# EAGLE design Arduino-Pro-Mini-CNC (EAGLE 6.5.0)
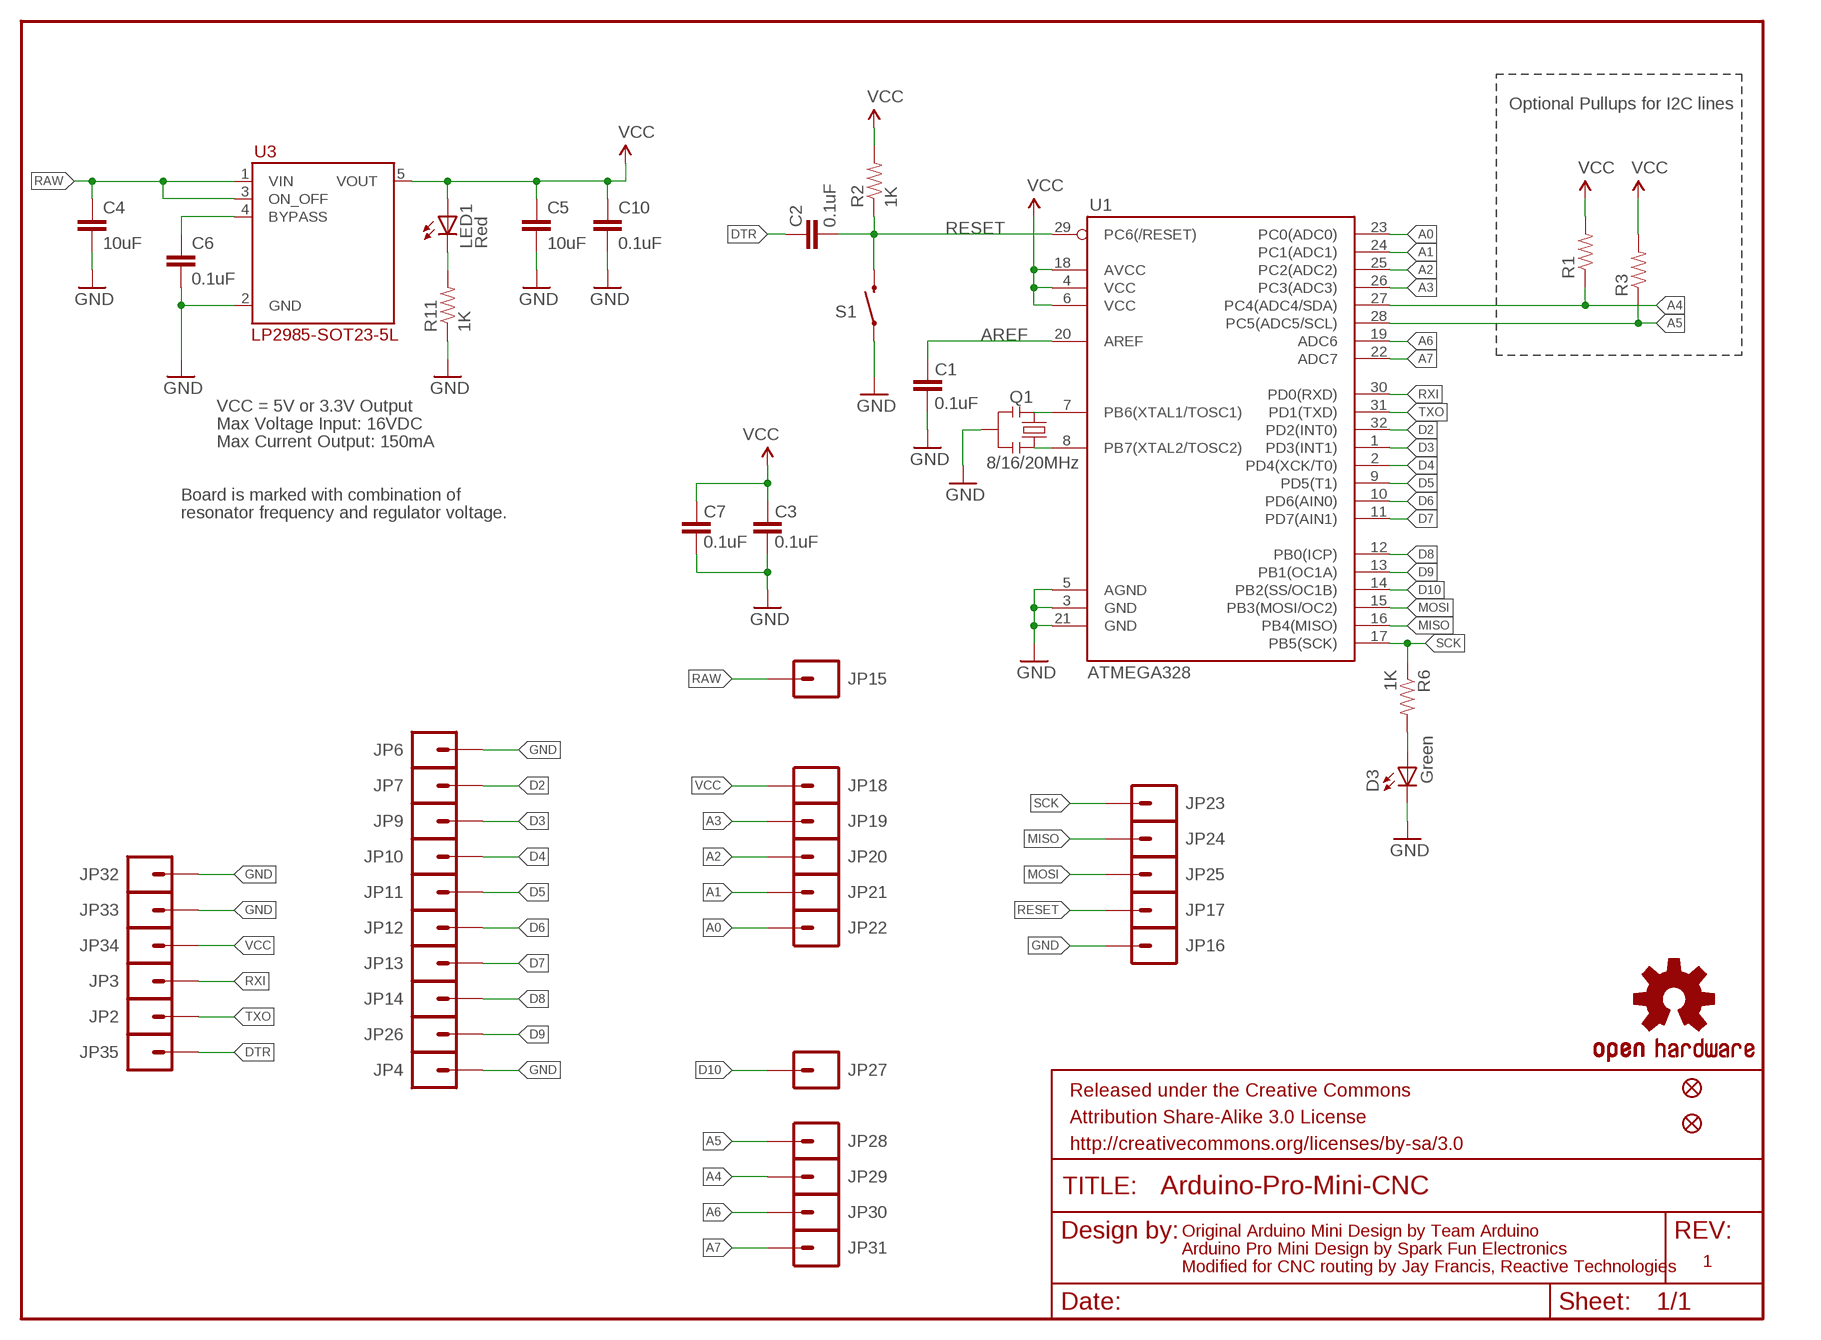
[diagram p0: schematic, sheet 1]

## Parts
C1  0.1uF  CAP0603-CAP  [0603-CAP]
C2  0.1uF  CAP0603-CAP  [0603-CAP]
C3  0.1uF  CAP0603-CAP  [0603-CAP]
C4  10uF  CAP0603-CAP  [0603-CAP]
C5  10uF  CAP0603-CAP  [0603-CAP]
C6  0.1uF  CAP0603-CAP  [0603-CAP]
C7  0.1uF  CAP0603-CAP  [0603-CAP]
C10  0.1uF  CAP0603-CAP  [0603-CAP]
D3  Green  LED  [0603-LED-ALT1]
FRAME1  FRAME-LETTER  [CREATIVE_COMMONS]
JP2  M01SMD_160X40  [PAD-160-040]
JP3  M01SMD_160X40  [PAD-160-040]
JP4  M01SMD_160X40  [PAD-160-040]
JP5  FIDUCIALUFIDUCIAL  [MICRO-FIDUCIAL]
JP6  M01SMD_160X40  [PAD-160-040]
JP7  M01SMD_160X40  [PAD-160-040]
JP8  FIDUCIALUFIDUCIAL  [MICRO-FIDUCIAL]
JP9  M01SMD_160X40  [PAD-160-040]
JP10  M01SMD_160X40  [PAD-160-040]
JP11  M01SMD_160X40  [PAD-160-040]
JP12  M01SMD_160X40  [PAD-160-040]
JP13  M01SMD_160X40  [PAD-160-040]
JP14  M01SMD_160X40  [PAD-160-040]
JP15  M01SMD_160X40  [PAD-160-040]
JP16  M01SMD_160X40  [PAD-160-040]
JP17  M01SMD_160X40  [PAD-160-040]
JP18  M01SMD_160X40  [PAD-160-040]
JP19  M01SMD_160X40  [PAD-160-040]
JP20  M01SMD_160X40  [PAD-160-040]
JP21  M01SMD_160X40  [PAD-160-040]
JP22  M01SMD_160X40  [PAD-160-040]
JP23  M01SMD_160X40  [PAD-160-040]
JP24  M01SMD_160X40  [PAD-160-040]
JP25  M01SMD_160X40  [PAD-160-040]
JP26  M01SMD_160X40  [PAD-160-040]
JP27  M01SMD_160X40  [PAD-160-040]
JP28  M01SMD_160X40  [PAD-160-040]
JP29  M01SMD_160X40  [PAD-160-040]
JP30  M01SMD_160X40  [PAD-160-040]
JP31  M01SMD_160X40  [PAD-160-040]
JP32  M01SMD_160X40  [PAD-160-040]
JP33  M01SMD_160X40  [PAD-160-040]
JP34  M01SMD_160X40  [PAD-160-040]
JP35  M01SMD_160X40  [PAD-160-040]
LED1  Red  LED  [0603-LED-ALT1]
Q1  8/16/20MHz  RESONATOR1:1  [RESONATOR-SMD-1:1]
R1  RESISTOR0603-RES  [0603-RES]
R2  1K  RESISTOR0603-RES  [0603-RES]
R3  RESISTOR0603-RES  [0603-RES]
R6  1K  RESISTOR0603-RES  [0603-RES]
R11  1K  RESISTOR0603-RES  [0603-RES]
S1  SWITCH-MOMENTARY-2-OMRON-B3U-1000P  [TACTILE-SWITCH-OMRON-B3U-1000P]
U1  ATMEGA328  ATMEGA168  [TQFP32-08]
U3  LP2985-SOT23-5L  [SOT23-5L]
U$3  OSHW-LOGOS  [OSHW-LOGO-S]

## Nets
A0: JP22.P$1 U1.23(PC0(ADC0))
A1: JP21.P$1 U1.24(PC1(ADC1))
A2: JP20.P$1 U1.25(PC2(ADC2))
A3: JP19.P$1 U1.26(PC3(ADC3))
A4: JP29.P$1 R1.1 U1.27(PC4(ADC4/SDA))
A5: JP28.P$1 R3.1 U1.28(PC5(ADC5/SCL))
A6: JP30.P$1 U1.19(ADC6)
A7: JP31.P$1 U1.22(ADC7)
AREF: C1.2 U1.20(AREF)
D2: JP7.P$1 U1.32(PD2(INT0))
D3: JP9.P$1 U1.1(PD3(INT1))
D4: JP10.P$1 U1.2(PD4(XCK/T0))
D5: JP11.P$1 U1.9(PD5(T1))
D6: JP12.P$1 U1.10(PD6(AIN0))
D7: JP13.P$1 U1.11(PD7(AIN1))
D8: JP14.P$1 U1.12(PB0(ICP))
D9: JP26.P$1 U1.13(PB1(OC1A))
D10: JP27.P$1 U1.14(PB2(SS/OC1B))
DTR: C2.2 JP35.P$1
GND [vcc]: C1.1 C3.1 C4.2 C5.2 C6.2 C7.1 C10.2 D3.C JP4.P$1 JP6.P$1 JP16.P$1 JP32.P$1 JP33.P$1 Q1.2 R11.1 S1.P$1 U1.3(GND) U1.5(AGND) U1.21(GND) U3.2(GND)
MISO: JP24.P$1 U1.16(PB4(MISO))
MOSI: JP25.P$1 U1.15(PB3(MOSI/OC2))
N$1: Q1.3 U1.8(PB7(XTAL2/TOSC2))
N$2: Q1.1 U1.7(PB6(XTAL1/TOSC1))
N$4: LED1.C R11.2
N$5: C6.1 U3.4(BYPASS)
N$7: D3.A R6.2
RAW [vcc]: C4.1 JP15.P$1 U3.1(VIN) U3.3(ON_OFF)
RESET: C2.1 JP17.P$1 R2.1 S1.P$2 U1.29(PC6(/RESET))
RXI: JP3.P$1 U1.30(PD0(RXD))
SCK: JP23.P$1 R6.1 U1.17(PB5(SCK))
TXO: JP2.P$1 U1.31(PD1(TXD))
VCC: C3.2 C5.1 C7.2 C10.1 JP18.P$1 JP34.P$1 LED1.A R1.2 R2.2 R3.2 U1.4(VCC) U1.6(VCC) U1.18(AVCC) U3.5(VOUT)

## Notes on the sheet
- Optional Pullups for I2C lines
- VCC = 5V or 3.3V Output
- Max Voltage Input: 16VDC
- Max Current Output: 150mA
- Board is marked with combination of
- resonator frequency and regulator voltage.
- Original Arduino Mini Design by Team Arduino
- Arduino Pro Mini Design by Spark Fun Electronics
- 1
- Modified for CNC routing by Jay Francis, Reactive Technologies

## Library data of the parts
C1-C7 C10 = SparkFun:CAP: Capacitor Standard 0603 ceramic capacitor, and 0.1" leaded capacitor.
D3 LED1 = Testing:LED: LEDs Standard schematic elements and footprints for 5mm, 3mm, 1206, and 0603 sized LEDs. 5mm - Spark Fun Electronics SKU : COM-00529 (and others)
FRAME1 = SparkFun-Aesthetics:FRAME-LETTER: Schematic Frame Standard 8.5x11 US Letter frame
JP2-JP4 JP6 JP7 JP9-JP35 = rt_library:M01: Header 1 Standard 1-pin 0.1" header. Use with straight break away headers (SKU : PRT-00116), right angle break away headers (PRT-00553), swiss pins (PRT-00743), machine pins (PRT-00117), and female headers (PRT-00115).
JP5 JP8 = SparkFun:FIDUCIAL: Fiducial Alignment Points Various fiducial points for machine vision alignment.
Q1 = Testing:RESONATOR: Resonator Small SMD resonator. This is the itty bitty 10/20MHz resonators with built in caps. CSTCE10M0G55 and CSTCE20M0V53. Footprint for SMD has been used in SFE production for years, and does work okay. 1:1 is an attempt to get larger fillets on the sides so it will be easier to inspect these solders in our AOI machine. The pads have been minimized to match the actual metal under the resonator. To see this relation, it includes an image import of the bottom side of the component. Imported to scale on layer 200.
R1-R3 R6 R11 = SparkFun:RESISTOR: Resistor Basic schematic elements and footprints for 0603, 1206, and PTH resistors.
S1 = rt_library:SWITCH-MOMENTARY-2: Various NO switches- pushbuttons, reed, etc
U1 = SparkFun:ATMEGA168
U3 = rt_library:LP2985
U$3 = SparkFun:OSHW-LOGO: Open Source Hardware Logo This logo indicates the piece of hardware it is found on incorporates a OSHW license and/or adheres to the definition of open source hardware found here: http://freedomdefined.org/OSHW

## Net classes
0 default: width 0.203 mm
1 vcc: width 0.254 mm

## Board
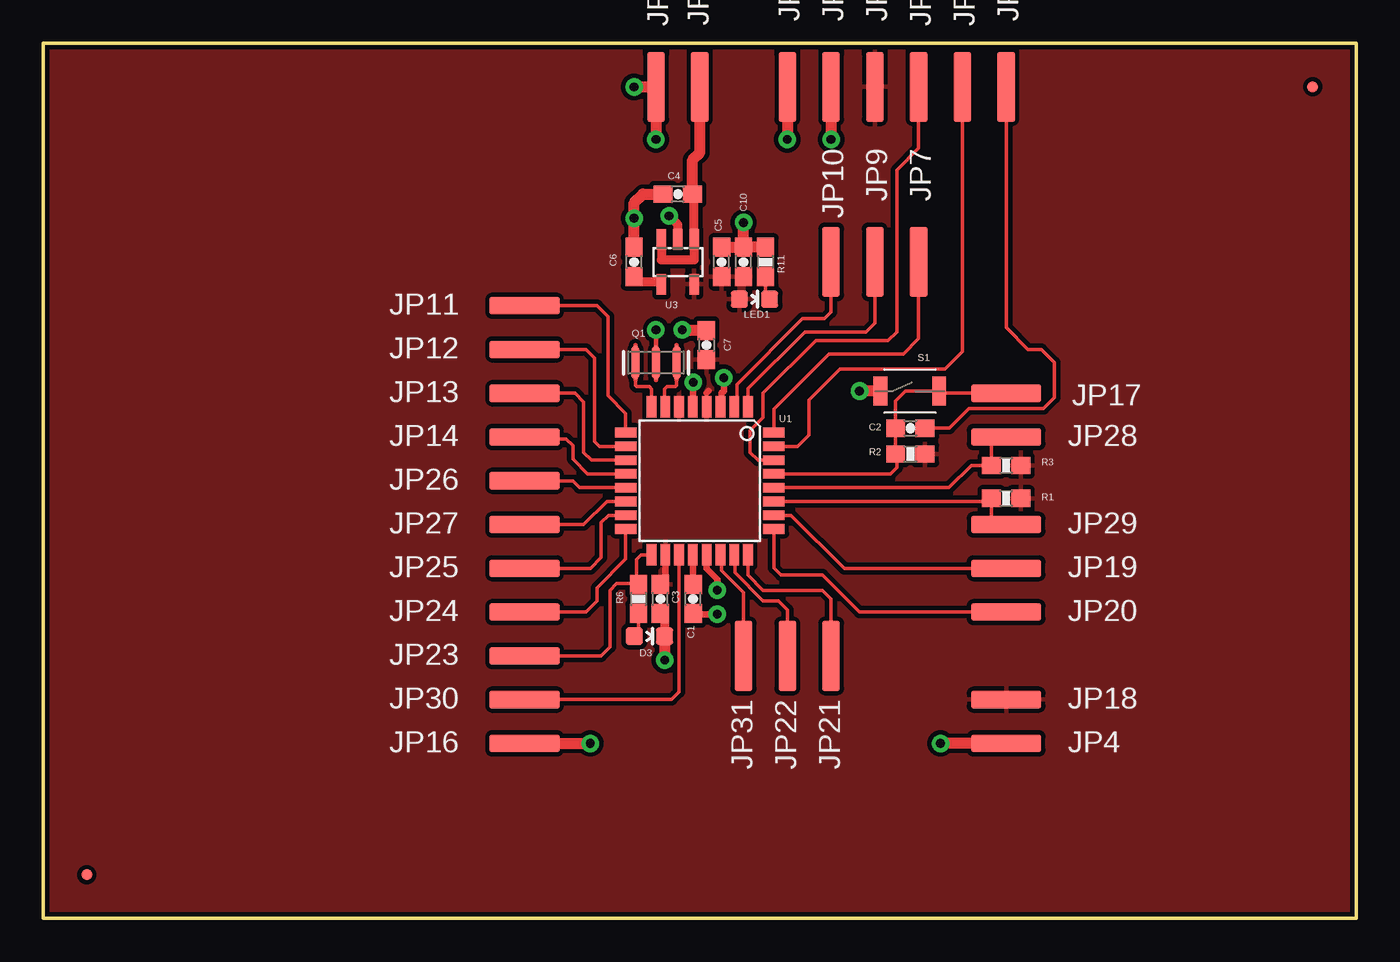
[diagram p1: board, top side]
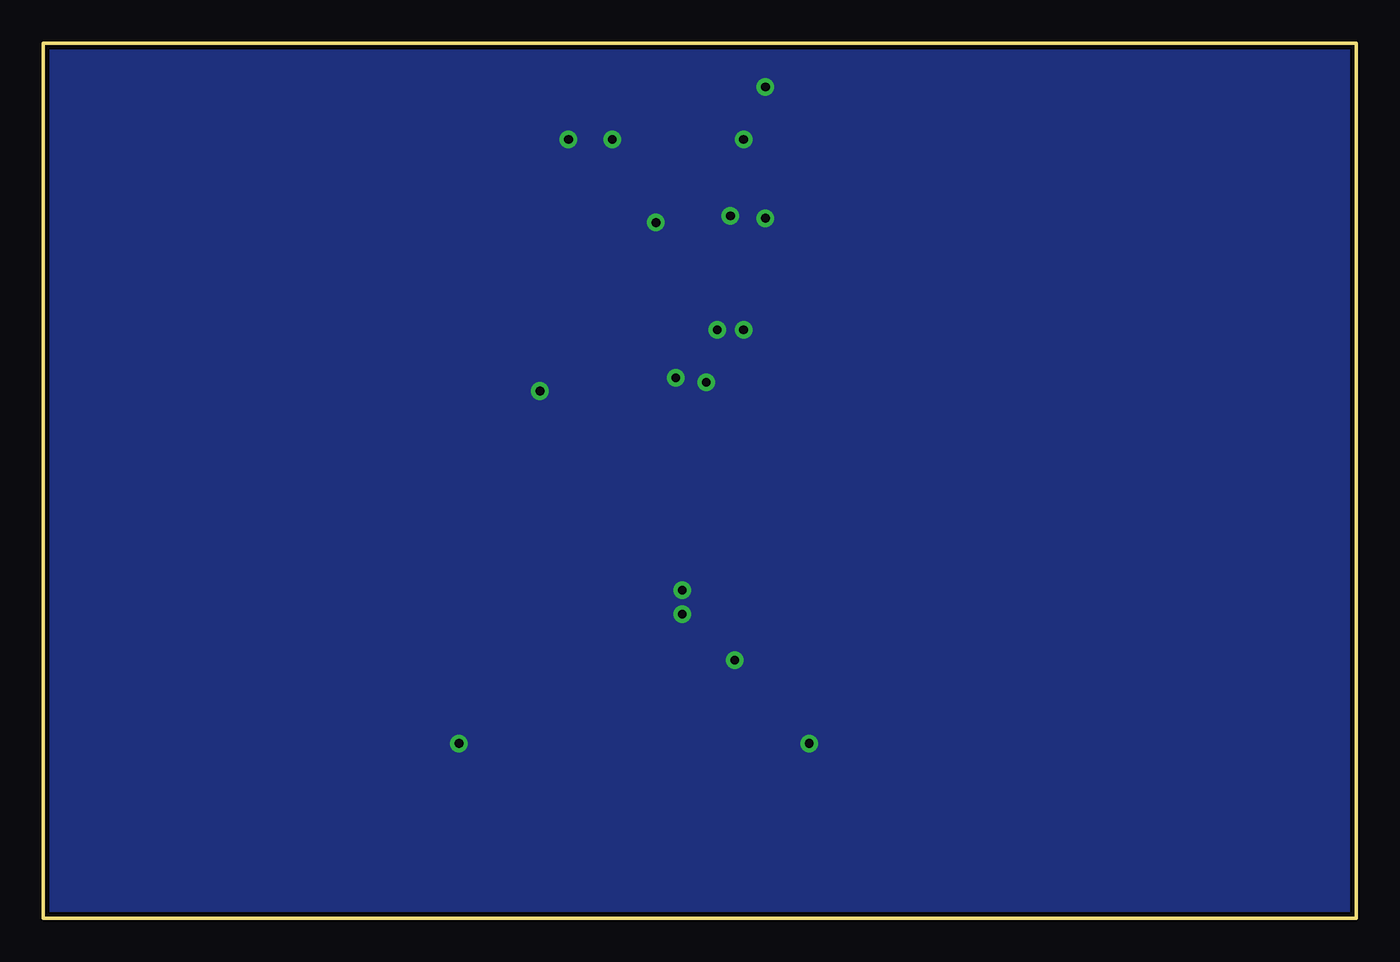
[diagram p2: board, bottom side, seen from below]

Size 76.2 x 50.8 mm. Coordinates in mm from the lower left corner, seen from the top.
Outline: 0,50.8 0,0 76.2,0 76.2,50.8 0,50.8
Copper layers (1*16): Top 0.035mm / dielectric 1.5mm / Bottom 0.035mm
Design rules "SparkFun-2-layer *": minimum track width 7mil, minimum drill 15mil, track to track 8mil, track to pad 8mil, pad to pad 8mil, via to via 8mil, smd to smd 8mil, copper to edge 8mil, drill to drill 8mil, minimum pad ring 12mil, minimum via ring 10mil, stop-mask expansion 4mil, vias tented up to drill 20mil, thermal gap 10mil

### Footprints (pad centres in the part's own frame; a part is rotated, then mirrored left to right if it is on the bottom)
0603-CAP = smd 1.1 x 1: 1 -0.85,0; 2 0.85,0
0603-LED-ALT1 = smd 1 x 1: A 0,-0.877; C 0,0.877
PAD-160-040 = smd 4.064 x 1.016: P$1 0,0
MICRO-FIDUCIAL = smd 0.635 x 0.635: 1 0,0
RESONATOR-SMD-1:1 = smd 0.45 x 1.905: 1 -1.2,0; 2 0,0; 3 1.2,0
0603-RES = smd 1.1 x 1: 1 -0.85,0; 2 0.85,0
TACTILE-SWITCH-OMRON-B3U-1000P = smd 0.8 x 1.7: P$1 -1.7,0; P$2 1.7,0
TQFP32-08 = smd 1.27 x 0.559: 1 -4.293,2.8; 2 -4.293,2; 3 -4.293,1.2; 4 -4.293,0.4; 5 -4.293,-0.4; 6 -4.293,-1.2; 7 -4.293,-2; 8 -4.293,-2.8; 17 4.293,-2.8; 18 4.293,-2; 19 4.293,-1.2; 20 4.293,-0.4; 21 4.293,0.4; 22 4.293,1.2; 23 4.293,2; 24 4.293,2.8 | smd 0.559 x 1.27: 9 -2.8,-4.293; 10 -2,-4.293; 11 -1.2,-4.293; 12 -0.4,-4.293; 13 0.4,-4.293; 14 1.2,-4.293; 15 2,-4.293; 16 2.8,-4.293; 25 2.8,4.293; 26 2,4.293; 27 1.2,4.293; 28 0.4,4.293; 29 -0.4,4.293; 30 -1.2,4.293; 31 -2,4.293; 32 -2.8,4.293
SOT23-5L = smd 0.55 x 1.2: 1 -0.95,-1.3; 2 0,-1.3; 3 0.95,-1.3; 4 0.95,1.3; 5 -0.95,1.3

### Placement (x,y rotation side)
C1  37.72,18.54 90 top
C2  50.32,28.45 0 top
C3  35.81,18.54 90 top
C4  36.83,42.04 180 top
C5  39.37,38.1 90 top
C6  34.29,38.1 90 top
C7  38.48,33.27 270 top
C10  40.64,38.1 90 top
D3  35.18,16.38 270 top
FRAME1  8.15,-11.43 0 top  (outside the outline)
JP2  53.34,48.26 270 top
JP3  50.8,48.26 270 top
JP4  55.88,10.16 0 top
JP5  2.54,2.54 0 top
JP6  35.56,48.26 270 top
JP7  50.8,38.1 270 top
JP8  73.66,48.26 0 top
JP9  48.26,38.1 270 top
JP10  45.72,38.1 270 top
JP11  27.94,35.56 0 top
JP12  27.94,33.02 0 top
JP13  27.94,30.48 0 top
JP14  27.94,27.94 0 top
JP15  38.1,48.26 90 top
JP16  27.94,10.16 0 top
JP17  55.88,30.48 180 top
JP18  55.88,12.7 0 top
JP19  55.88,20.32 0 top
JP20  55.88,17.78 0 top
JP21  45.72,15.24 90 top
JP22  43.18,15.24 90 top
JP23  27.94,15.24 0 top
JP24  27.94,17.78 0 top
JP25  27.94,20.32 0 top
JP26  27.94,25.4 0 top
JP27  27.94,22.86 0 top
JP28  55.88,27.94 0 top
JP29  55.88,22.86 0 top
JP30  27.94,12.7 0 top
JP31  40.64,15.24 90 top
JP32  45.72,48.26 270 top
JP33  43.18,48.26 270 top
JP34  48.26,48.26 270 top
JP35  55.88,48.26 270 top
LED1  41.27,35.94 270 top
Q1  35.56,32.26 180 top
R1  55.88,24.38 0 top
R2  50.32,26.95 0 top
R3  55.88,26.29 0 top
R6  34.54,18.54 270 top
R11  41.91,38.1 270 top
S1  50.29,30.61 0 top
U1  38.1,25.4 270 top
U3  36.83,38.1 180 top
U$3  78.46,-15.14 0 top  (outside the outline)

### Tracks (layer width: path | path; a pad name or v marks a point on that pad's centre or on a via)
A0
  Top 0.203: JP22.P$1 43.18,17.91 42.67,18.41 41.78,18.41 40.13,20.07 40.13,21.07 U1.23
A1
  Top 0.203: U1.24 40.9,19.93 41.78,19.05 45.21,19.05 45.72,18.54 JP21.P$1
A2
  Top 0.203: U1.25 42.39,20.34 42.8,19.94 45.21,19.94 47.37,17.78 JP20.P$1
A3
  Top 0.203: U1.26 43.4,23.4 46.48,20.32 JP19.P$1
A4
  Top 0.203: U1.27 54.85,24.2 R1.1 55.03,22.95 55.12,22.86 JP29.P$1
A5
  Top 0.203: U1.28 52.56,25 53.85,26.29 R3.1 55.03,27.9 54.99,27.94 JP28.P$1
A6
  Top 0.203: U1.19 36.9,13.15 36.45,12.7 JP30.P$1
A7
  Top 0.203: JP31.P$1 40.64,18.92 39.37,20.19 39.37,21.04 U1.22
AREF
  Top 0.381: U1.20 37.7,19.41 C1.2
D2
  Top 0.203: U1.32 42.39,29.57 45.59,32.77 49.91,32.77 50.8,33.66 JP7.P$1
D3
  Top 0.203: U1.1 40.9,30.74 44.2,34.04 47.75,34.04 48.26,34.54 JP9.P$1
D4
  Top 0.203: JP10.P$1 45.72,35.18 45.34,34.8 44.07,34.8 40.26,30.99 40.26,29.72 40.23,29.69 U1.2
D5
  Top 0.203: U1.9 33.81,29.31 32.77,30.35 32.77,34.92 32.13,35.56 JP11.P$1
D6
  Top 0.203: U1.10 32.29,27.4 32,27.69 32,32.51 31.5,33.02 JP12.P$1
D7
  Top 0.203: U1.11 31.82,26.6 31.37,27.05 31.37,29.97 30.86,30.48 JP13.P$1
D8
  Top 0.203: U1.12 31.6,25.8 30.73,26.67 30.73,27.43 30.35,27.81 28.07,27.81 JP14.P$1
D9
  Top 0.203: U1.13 31.13,25 30.73,25.4 JP26.P$1
D10
  Top 0.203: U1.14 32.71,24.2 31.37,22.86 JP27.P$1
DTR
  Top 0.203: C2.2 52.58,28.45 53.72,29.59 58.04,29.59 58.67,30.23 58.67,32.26 57.91,33.02 57.15,33.02 55.88,34.29 JP35.P$1
GND  (via drill 0.51)
  Top 0.254: 35.56,33.27 v35.56,34.16
  Top 0.381: 37.72,29.69 U1.5 37.72,29.71 v37.72,31.11 | 38.48,21.11 U1.21 38.48,21.09 38.48,20.32 39.12,19.68 v39.12,19.05 | U1.3 39.24,29.75 39.27,29.75 39.37,29.84 39.37,30.48 39.5,30.61 v39.5,31.37 | v39.12,17.65 37.76,17.65 C1.1
  Top 0.508: C3.1 36.06,17.69 D3.C | U3.2 36.83,40.26 v36.32,40.77
  Top 0.635: v34.29,48.26 JP6.P$1 v35.56,45.21 | JP33.P$1 v43.18,45.21 | JP32.P$1 v45.72,45.21 | C6.2 v34.29,40.64 | v34.29,40.64 34.29,40.77 | C5.2 C10.2 | C10.2 v40.64,40.39 | R11.1 C10.2 | S1.P$1 v47.37,30.61 | D3.C v36.07,14.99 | JP4.P$1 v52.07,10.16 | JP16.P$1 v31.75,10.16 | v34.29,40.64 34.29,41.53 34.8,42.04 C4.2 | C7.1 37.12,34.12 v37.08,34.16
  pour Bottom (isolate 0.254, rank 6): 0,50.8 76.2,50.8 76.2,0 0,0
MISO
  Top 0.203: U1.16 33.81,20.85 32.13,19.18 32.13,18.41 31.5,17.78 JP24.P$1
MOSI
  Top 0.203: U1.15 32.8,23.4 32.38,22.99 32.38,20.95 31.75,20.32 JP25.P$1
N$1
  Top 0.203: 34.36,31.24 34.36,30.92 34.42,30.86 35.18,30.86 35.31,30.73 U1.8
N$2
  Top 0.203: 36.76,31.24 36.76,30.92 36.7,30.86 36.2,30.86 36.07,30.73 36.07,29.73 U1.7
N$4
  Top 0.203: R11.2 41.91,36.18 LED1.C
N$5
  Top 0.508: C6.1 34.29,36.96 35.72,36.96 U3.4
N$7
  Top 0.203: R6.2 34.54,16.62 D3.A
RAW
  Top 0.508: C4.1 37.78,41.94 U3.1 37.78,38.23 35.88,38.23 U3.3
  Top 0.635: C4.1 37.68,44.03 38.1,44.45 JP15.P$1
RESET
  Top 0.203: JP17.P$1 52.12,30.48 S1.P$2 50.04,30.61 49.47,30.04 C2.1 R2.1 49.53,26.89 49.53,26.16 49.17,25.8 U1.29
RXI
  Top 0.203: U1.30 41.47,26.6 41.02,27.05 41.02,28.32 41.78,29.08 41.78,30.48 44.83,33.53 49.02,33.53 49.53,34.04 49.53,43.43 50.8,44.7 JP3.P$1
SCK
  Top 0.203: U1.17 34.7,21.11 34.42,20.83 34.42,19.52 R6.1 34.51,19.43 33.27,19.43 32.89,19.05 32.89,15.75 32.38,15.24 JP23.P$1
TXO
  Top 0.203: U1.31 43.78,27.4 44.45,28.07 44.45,30.1 46.23,31.88 52.32,31.88 53.34,32.89 JP2.P$1
VCC
  Top 0.381: U1.18 36.1,19.68 C3.2 | 38.5,30.5 38.61,30.61
  pour Top (isolate 0.254, rank 6): 0,50.8 76.2,50.8 76.2,0 0,0

### Text on the board
tValues: Arduino Pro Mini | Valid combinations: | 168V / 3.3V Reg / 8MHz | 168 / 5V Reg / 16MHz | 168 / 5V Reg / 20MHz | Mark back accordingly
tDocu: Original Arduino Mini Design by Team Arduino / Arduino Pro Mini Design by SparkFun Electronics / Revised by Pete Lewis / Modified for CNC routing by Jay Francis, Reactive Technologies